# Altium schematic sheet Power.SchDoc
size A; SheetNumber: 3
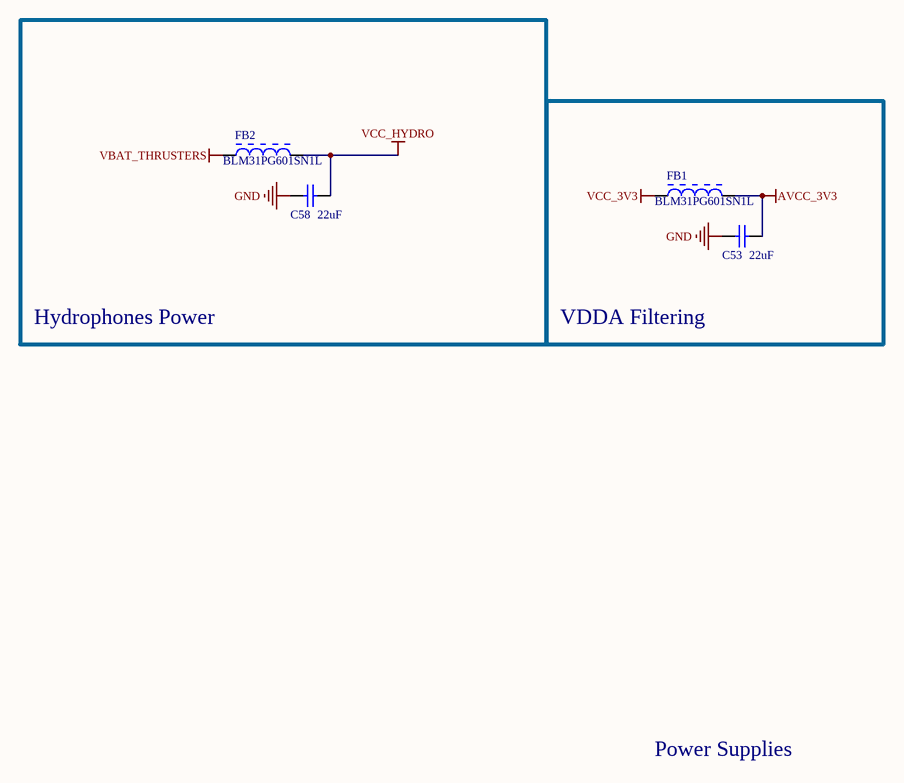
[diagram p0: Power.SchDoc]

## Parts
C53  22uF  [CAPC1210(3225)100_N]
C58  22uF  [CAPC1210(3225)100_N]
FB1  BLM31PG601SN1L  [MURA-BLM31-B-CHIP-2_V]
FB2  BLM31PG601SN1L  [MURA-BLM31-B-CHIP-2_V]

## Blocks framed on the sheet
Hydrophones Power: C58 FB2
VDDA Filtering: C53 FB1

## Nets
AVCC_3V3: C53.1 FB1.2
GND: C53.2 C58.2
VBAT_THRUSTERS: FB2.1
VCC_3V3: FB1.1
VCC_HYDRO: C58.1 FB2.2

## Notes on the sheet
- Power Supplies

## Library data of the parts
C53 C58 = CMP-1038-01290-1: CAP 22nF 16V ±5% 1210 (3225 Metric) Thickness 1mm SMD; Case-EIA: 1210; Tolerance: ±20%; Case-Metric: 3225; Value: 22uF; Max Thickness: 1 mm; Technology: SMT; Rated Voltage: 16 V
FB1 FB2 = CMP-0686-00744-2: Chip Ferrite Bead for Power Lines, 600 Ohm, 1500 mA, -55 to 125 degC, 3.2 x 1.6 x 1.3 mm SMD, Tape and Reel; Manufacturer: Murata; DC Resistance: 0.08 Ohm Max.; Impedance (at 100 MHz): 600 Ohm +/- 25%; Rated Current: 1500 mA; ComponentLink1URL: http://www.murata.com/; ComponentLink3Description: Package Specification; DatasheetVersion: 08/2013; PartNumber: BLM31PG601SN1L; Mounting Technology: Surface Mount; ComponentLink3URL: http://www.murata.com/products/catalog/pdf/c31e.pdf; ComponentLink2Description: Datasheet; PackageDescription: 2-Pin Chip, Body 3.2 x 1.6 mm; Operating Temperature Range: -55 to 125 degC; ComponentLink1Description: Manufacturer URL; ComponentLink2URL: http://www.murata.com/products/catalog/pdf/c31e.pdf; PackageReference: BLM31-2; Packing: Tape and Reel